# EAGLE design iceWerx Carrier (EAGLE 9.6.2)
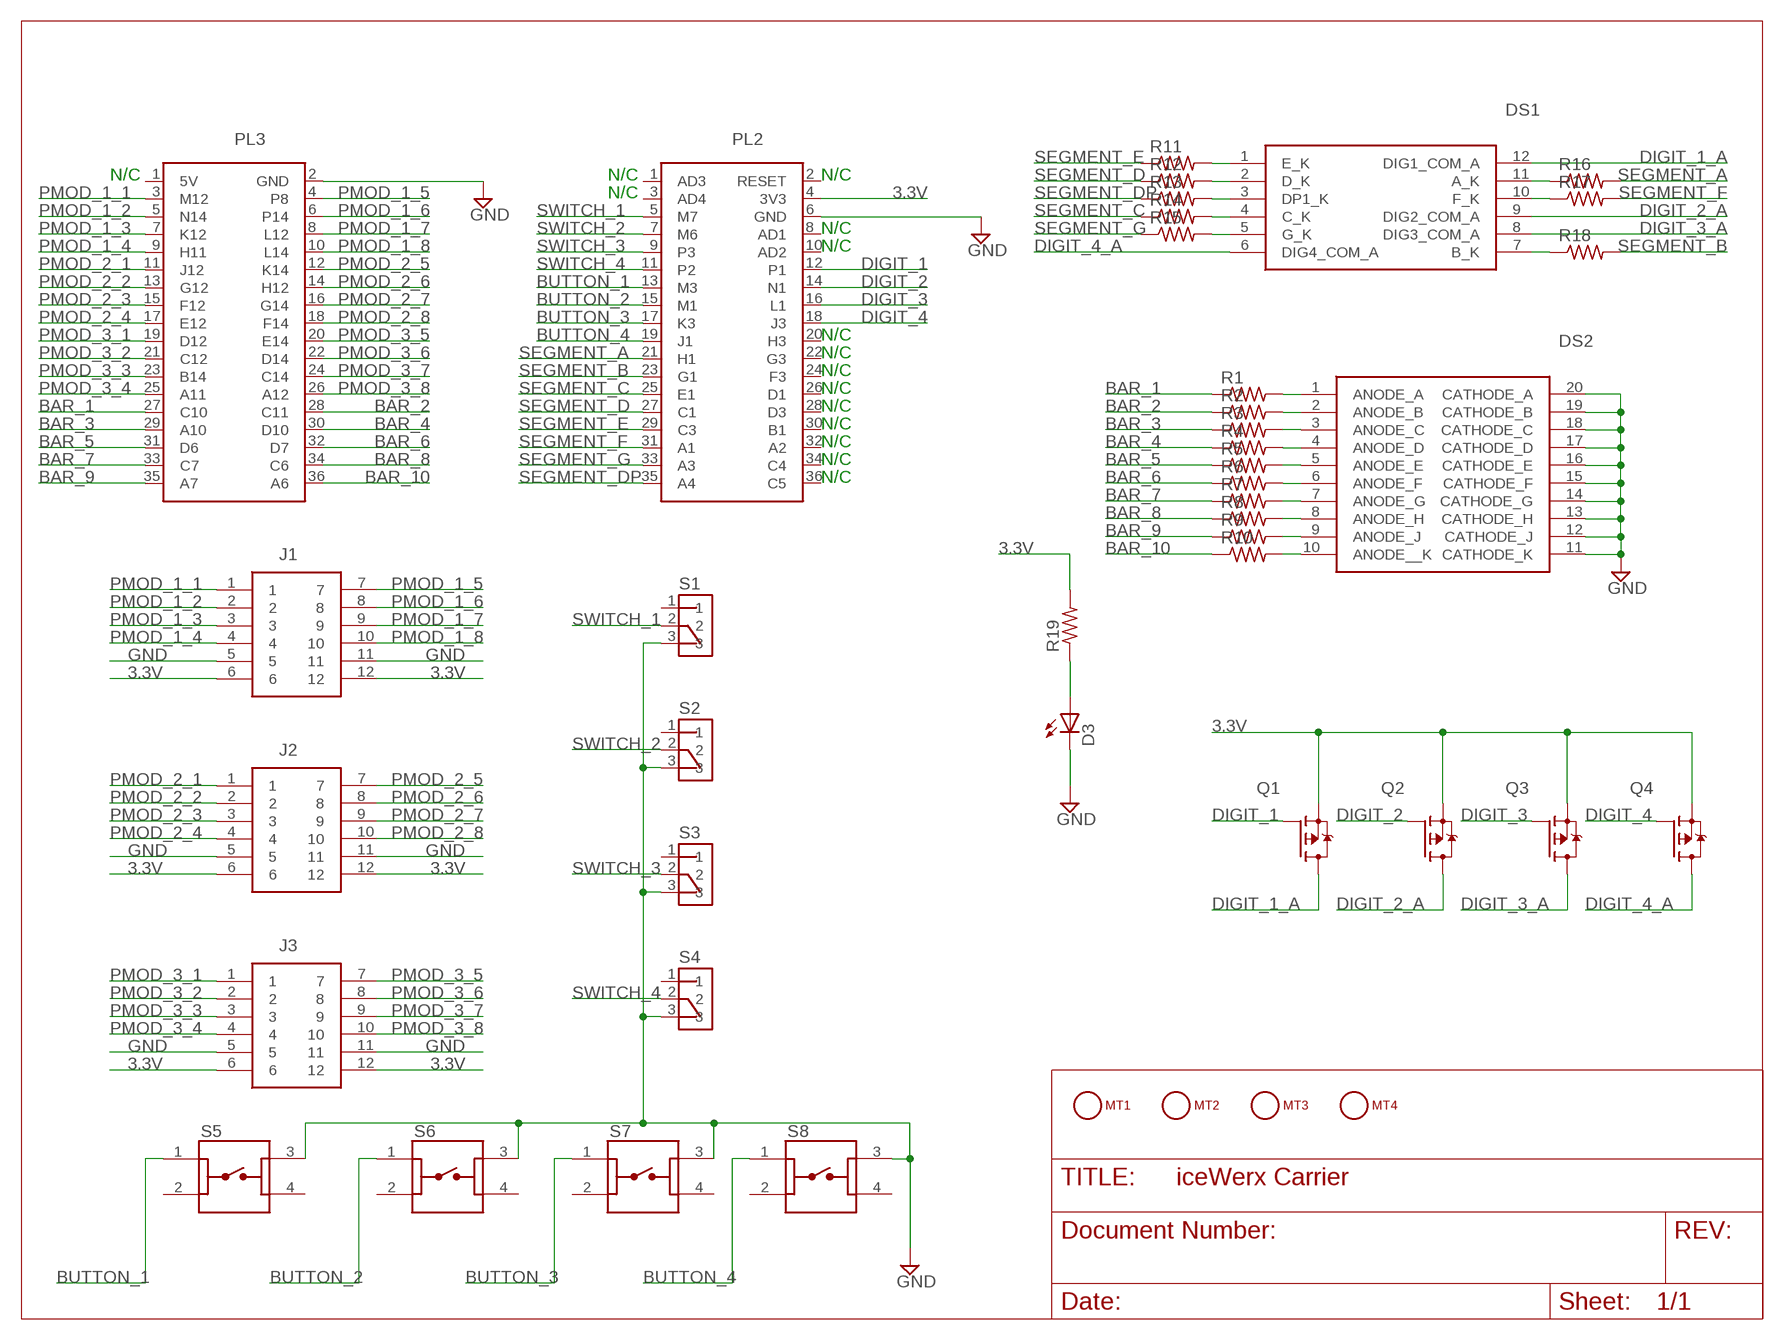
[diagram p0: schematic, sheet 1]

## Parts
D3  LED5MM  [LED5MM]
DS1  LDQ-M282RI  [LDQM282RI]
DS2  LTA-1000G  [DIPS762W50P254L2527H825Q20N]
J1  PMOD-SOCKET-FOR-HOST-BOARD  [PMOD-SOCKET-FOR-HOST-BOARD]
J2  PMOD-SOCKET-FOR-HOST-BOARD  [PMOD-SOCKET-FOR-HOST-BOARD]
J3  PMOD-SOCKET-FOR-HOST-BOARD  [PMOD-SOCKET-FOR-HOST-BOARD]
MT1  MOUNTING_HOLE-125_250_ROUND  [MT_125_250]
MT2  MOUNTING_HOLE-125_250_ROUND  [MT_125_250]
MT3  MOUNTING_HOLE-125_250_ROUND  [MT_125_250]
MT4  MOUNTING_HOLE-125_250_ROUND  [MT_125_250]
PL2  ICEWERX-PL2  [TE_4-1734506-1]
PL3  ICEWERX-PL3  [TE_4-1734506-1]
Q1  NX2301P  [SOT95P230X110-3N]
Q2  NX2301P  [SOT95P230X110-3N]
Q3  NX2301P  [SOT95P230X110-3N]
Q4  NX2301P  [SOT95P230X110-3N]
R1  R-US_0204/5  [0204/5]
R2  R-US_0204/5  [0204/5]
R3  R-US_0204/5  [0204/5]
R4  R-US_0204/5  [0204/5]
R5  R-US_0204/5  [0204/5]
R6  R-US_0204/5  [0204/5]
R7  R-US_0204/5  [0204/5]
R8  R-US_0204/5  [0204/5]
R9  R-US_0204/5  [0204/5]
R10  R-US_0204/5  [0204/5]
R11  R-US_0204/5  [0204/5]
R12  R-US_0204/5  [0204/5]
R13  R-US_0204/5  [0204/5]
R14  R-US_0204/5  [0204/5]
R15  R-US_0204/5  [0204/5]
R16  R-US_0204/5  [0204/5]
R17  R-US_0204/5  [0204/5]
R18  R-US_0204/5  [0204/5]
R19  R-US_0204/5  [0204/5]
S1  OS102011MS2QN1  [SW_OS102011MS2QN1]
S2  OS102011MS2QN1  [SW_OS102011MS2QN1]
S3  OS102011MS2QN1  [SW_OS102011MS2QN1]
S4  OS102011MS2QN1  [SW_OS102011MS2QN1]
S5  1825910-7  [SW_1825910-7]
S6  1825910-7  [SW_1825910-7]
S7  1825910-7  [SW_1825910-7]
S8  1825910-7  [SW_1825910-7]

## Nets
3.3V: J1.6 J1.12 J2.6 J2.12 J3.6 J3.12 PL2.4(3V3) Q1.2(S) Q2.2(S) Q3.2(S) Q4.2(S) R19.2
BAR_1: PL3.27(C10) R1.1
BAR_2: PL3.28(C11) R2.1
BAR_3: PL3.29(A10) R3.1
BAR_4: PL3.30(D10) R4.1
BAR_5: PL3.31(D6) R5.1
BAR_6: PL3.32(D7) R6.1
BAR_7: PL3.33(C7) R7.1
BAR_8: PL3.34(C6) R8.1
BAR_9: PL3.35(A7) R9.1
BAR_10: PL3.36(A6) R10.1
BUTTON_1: PL2.13(M3) S5.1
BUTTON_2: PL2.15(M1) S6.1
BUTTON_3: PL2.17(K3) S7.1
BUTTON_4: PL2.19(J1) S8.1
DIGIT_1: PL2.12(P1) Q1.1(G)
DIGIT_1_A: DS1.12(DIG1_COM_A) Q1.3(D)
DIGIT_2: PL2.14(N1) Q2.1(G)
DIGIT_2_A: DS1.9(DIG2_COM_A) Q2.3(D)
DIGIT_3: PL2.16(L1) Q3.1(G)
DIGIT_3_A: DS1.8(DIG3_COM_A) Q3.3(D)
DIGIT_4: PL2.18(J3) Q4.1(G)
DIGIT_4_A: DS1.6(DIG4_COM_A) Q4.3(D)
GND: D3.K(C) DS2.11(CATHODE_K) DS2.12(CATHODE_J) DS2.13(CATHODE_H) DS2.14(CATHODE_G) DS2.15(CATHODE_F) DS2.16(CATHODE_E) DS2.17(CATHODE_D) DS2.18(CATHODE_C) DS2.19(CATHODE_B) DS2.20(CATHODE_A) J1.5 J1.11 J2.5 J2.11 J3.5 J3.11 PL2.6(GND) PL3.2(GND) S1.3 S2.3 S3.3 S4.3 S5.3 S6.3 S7.3 S8.3
N$1: DS2.8(ANODE_H) R8.2
N$2: DS2.1(ANODE_A) R1.2
N$3: DS2.2(ANODE_B) R2.2
N$4: DS2.3(ANODE_C) R3.2
N$5: DS2.4(ANODE_D) R4.2
N$6: DS2.5(ANODE_E) R5.2
N$7: DS2.6(ANODE_F) R6.2
N$8: DS2.9(ANODE_J) R9.2
N$9: DS2.7(ANODE_G) R7.2
N$10: DS2.10(ANODE__K) R10.2
N$11: DS1.7(B_K) R18.1
N$12: DS1.10(F_K) R17.1
N$13: DS1.11(A_K) R16.1
N$14: DS1.1(E_K) R11.2
N$15: DS1.2(D_K) R12.2
N$16: DS1.3(DP1_K) R13.2
N$17: DS1.4(C_K) R14.2
N$18: DS1.5(G_K) R15.2
N$19: D3.A R19.1
PMOD_1_1: J1.1 PL3.3(M12)
PMOD_1_2: J1.2 PL3.5(N14)
PMOD_1_3: J1.3 PL3.7(K12)
PMOD_1_4: J1.4 PL3.9(H11)
PMOD_1_5: J1.7 PL3.4(P8)
PMOD_1_6: J1.8 PL3.6(P14)
PMOD_1_7: J1.9 PL3.8(L12)
PMOD_1_8: J1.10 PL3.10(L14)
PMOD_2_1: J2.1 PL3.11(J12)
PMOD_2_2: J2.2 PL3.13(G12)
PMOD_2_3: J2.3 PL3.15(F12)
PMOD_2_4: J2.4 PL3.17(E12)
PMOD_2_5: J2.7 PL3.12(K14)
PMOD_2_6: J2.8 PL3.14(H12)
PMOD_2_7: J2.9 PL3.16(G14)
PMOD_2_8: J2.10 PL3.18(F14)
PMOD_3_1: J3.1 PL3.19(D12)
PMOD_3_2: J3.2 PL3.21(C12)
PMOD_3_3: J3.3 PL3.23(B14)
PMOD_3_4: J3.4 PL3.25(A11)
PMOD_3_5: J3.7 PL3.20(E14)
PMOD_3_6: J3.8 PL3.22(D14)
PMOD_3_7: J3.9 PL3.24(C14)
PMOD_3_8: J3.10 PL3.26(A12)
SEGMENT_A: PL2.21(H1) R16.2
SEGMENT_B: PL2.23(G1) R18.2
SEGMENT_C: PL2.25(E1) R14.1
SEGMENT_D: PL2.27(C1) R12.1
SEGMENT_DP: PL2.35(A4) R13.1
SEGMENT_E: PL2.29(C3) R11.1
SEGMENT_F: PL2.31(A1) R17.2
SEGMENT_G: PL2.33(A3) R15.1
SWITCH_1: PL2.5(M7) S1.2
SWITCH_2: PL2.7(M6) S2.2
SWITCH_3: PL2.9(P3) S3.2
SWITCH_4: PL2.11(P2) S4.2
Unconnected: MT1.1 MT2.1 MT3.1 MT4.1 PL2.1(AD3) PL2.2(RESET) PL2.3(AD4) PL2.8(AD1) PL2.10(AD2) PL2.20(H3) PL2.22(G3) PL2.24(F3) PL2.26(D1) PL2.28(D3) PL2.30(B1) PL2.32(A2) PL2.34(C4) PL2.36(C5) PL3.1(5V) S1.1 S2.1 S3.1 S4.1 S5.2 S5.4 S6.2 S6.4 S7.2 S7.4 S8.2 S8.4

## Notes on the sheet
- N/C | N/C | N/C
- N/C
- N/C
- N/C
- N/C
- N/C
- N/C
- N/C
- N/C
- N/C
- N/C
- N/C
- N/C

## Library data of the parts
D3 = eagle-library-engr-240-f22:LED: LED OSRAM: - CHIPLED LG R971, LG N971, LY N971, LG Q971, LY Q971, LO R971, LY R971 LH N974, LH R974 LS Q976, LO Q976, LY Q976 LO Q996 - Hyper CHIPLED LW Q18S LB Q993, LB Q99A, LB R99A - SideLED LS A670, LO A670, LY A670, LG A670, LP A670 LB A673, LV A673, LT A673, LW A673 LH A674 LY A675 LS A676, LA A676, LO A676, LY A676, LW A676 LS A679, LY A679, LG A679 - Hyper Micro SIDELED® LS Y876, LA Y876, LO Y876, LY Y876 LT Y87S - SmartLED LW L88C, LW L88S LB L89C, LB L89S, LG L890 LS L89K, LO L89K, LY L89K LS L896, LA L896, LO L896, LY L896 - TOPLED LS T670, LO T670, LY T670, LG T670, LP T670 LSG T670, LSP T670, LSY T670, LOP T670, LYG T670 LG T671, LOG T671, LSG T671 LB T673, LV T673, LT T673, LW T673 LH T674 LS T676, LA T676, LO T676, LY T676, LB T676, LH T676, LSB T676, LW T676 LB T67C, LV T67C, LT T67C, LS T67K, LO T67K, LY T67K, LW E67C LS E67B, LA E67B, LO E67B, LY E67B, LB E67C, LV E67C, LT E67C LW T67C LS T679, LY T679, LG T679 LS T770, LO T770, LY T770, LG T770, LP T770 LB T773, LV T773, LT T773, LW T773 LH T774 LS E675, LA E675, LY E675, LS T675 LS T776, LA T776, LO T776, LY T776, LB T776 LHGB T686 LT T68C, LB T68C - Hyper Mini TOPLED® LB M676 - Mini TOPLED Santana® LG M470 LS M47K, LO M47K, LY M47K Source: http://www.osram.convergy.de/
DS1 = eagle-library-engr-240-f22:LDQ-M282RI: LED Displays & Accessories LED Display Source: Datasheet <https://componentsearchengine.com/Datasheets/1/LDQ-M282RI.pdf>; DESCRIPTION: LED Displays & Accessories LED Display; HEIGHT: 6.05mm; MANUFACTURER_NAME: Lumex; MANUFACTURER_PART_NUMBER: LDQ-M282RI; MOUSER_PART_NUMBER: 696-LDQ-M282RI; MOUSER_PRICE-STOCK: https://www.mouser.com/Search/Refine.aspx?Keyword=696-LDQ-M282RI
DS2 = eagle-library-engr-240-f22:LTA-1000G: LED Uni-Color Green 565nm 20-Pin PDIP Source: Datasheet <https://optoelectronics.liteon.com/upload/download/DS-30-92-0809/A1000G.pdf>; DESCRIPTION: LED Uni-Color Green 565nm 20-Pin PDIP; HEIGHT: 8.25mm; MANUFACTURER_NAME: Lite-On; MANUFACTURER_PART_NUMBER: LTA-1000G; MOUSER_PART_NUMBER: 859-LTA-1000G; MOUSER_PRICE-STOCK: https://www.mouser.co.uk/ProductDetail/Lite-On/LTA-1000G?qs=%2FTKcI5XXRKq0QINzVmwJHg%3D%3D
J1-J3 = eagle-library-engr-240-f22:PMOD-SOCKET-FOR-HOST-BOARD
MT1-MT4 = eagle-library-engr-240-f22:MOUNTING_HOLE
PL2 = eagle-library-engr-240-f22:ICEWERX-PL2
PL3 = eagle-library-engr-240-f22:ICEWERX-PL3
Q1-Q4 = eagle-library-engr-240-f22:NX2301P; MANUFACTURER: Nexperia; MAXIMUM_PACKAGE_HEIGHT: 1.10 mm; PARTREV: 1; SNAPEDA_PN: NX2301P; STANDARD: IPC 7351B
R1-R19 = eagle-library-engr-240-f22:R-US_: RESISTOR, American symbol
S1-S4 = eagle-library-engr-240-f22:OS102011MS2QN1: Switch Slide ON ON SPDT Top Slide 0.1A 12VDC 10000Cycles PC Pins Thru-Hole Bulk; MANUFACTURER: C&K; STANDARD: MANUFACTURER RECOMMENDATIONS
S5-S8 = eagle-library-engr-240-f22:1825910-7: Switch Tactile OFF (ON) SPST Round Button PC Pins 0.05A 24VDC 100000Cycles 2.55N Thru-Hole Loose; MANUFACTURER: TE Connectivity; PARTREV: C10; STANDARD: Manufacturer Recommendation

## Board
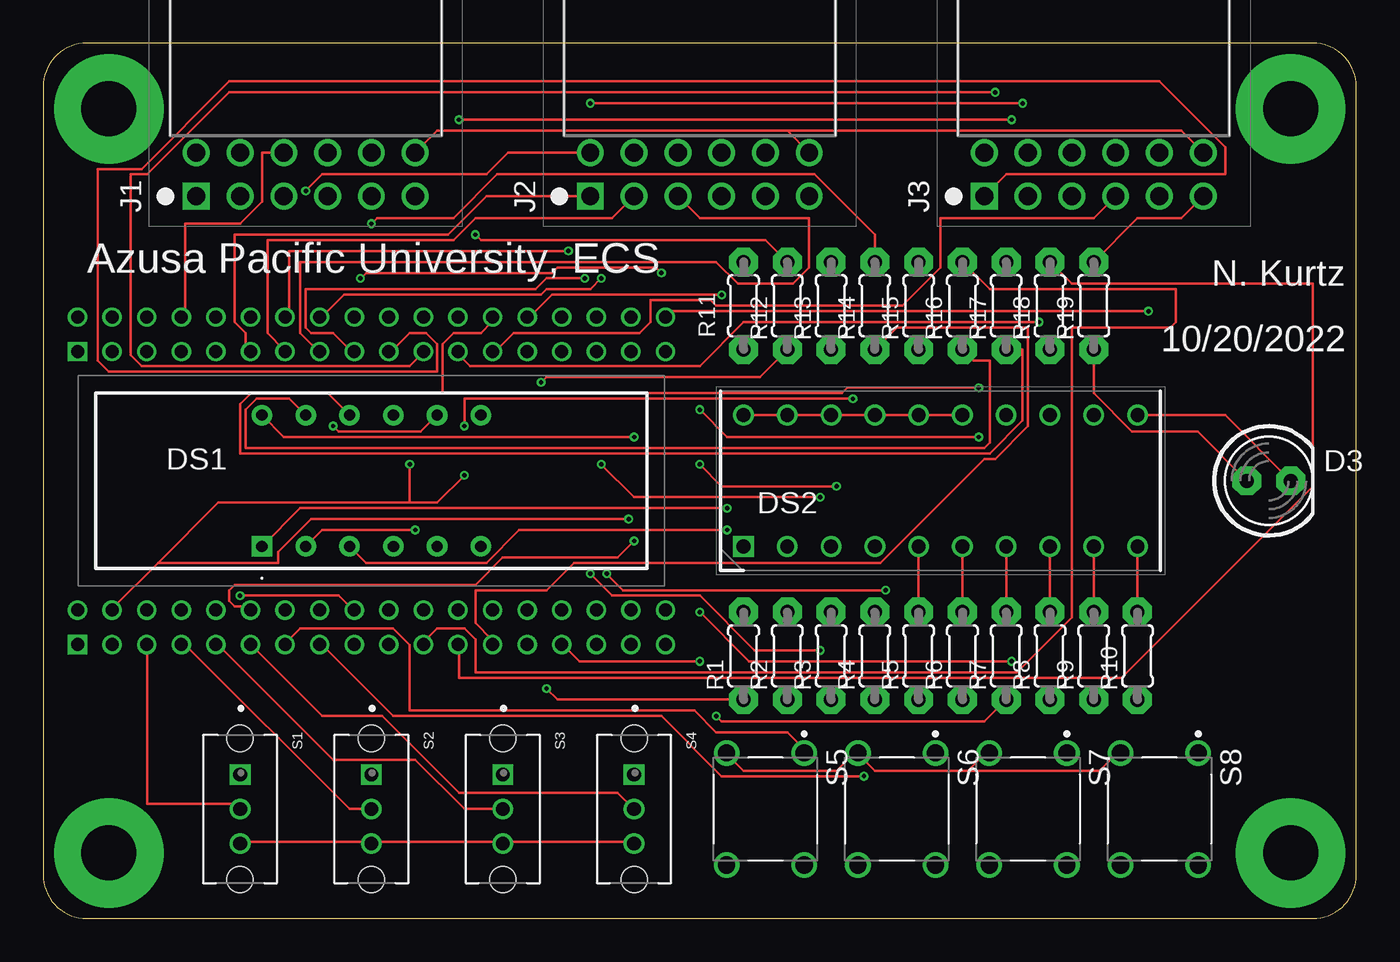
[diagram p1: board, top side]
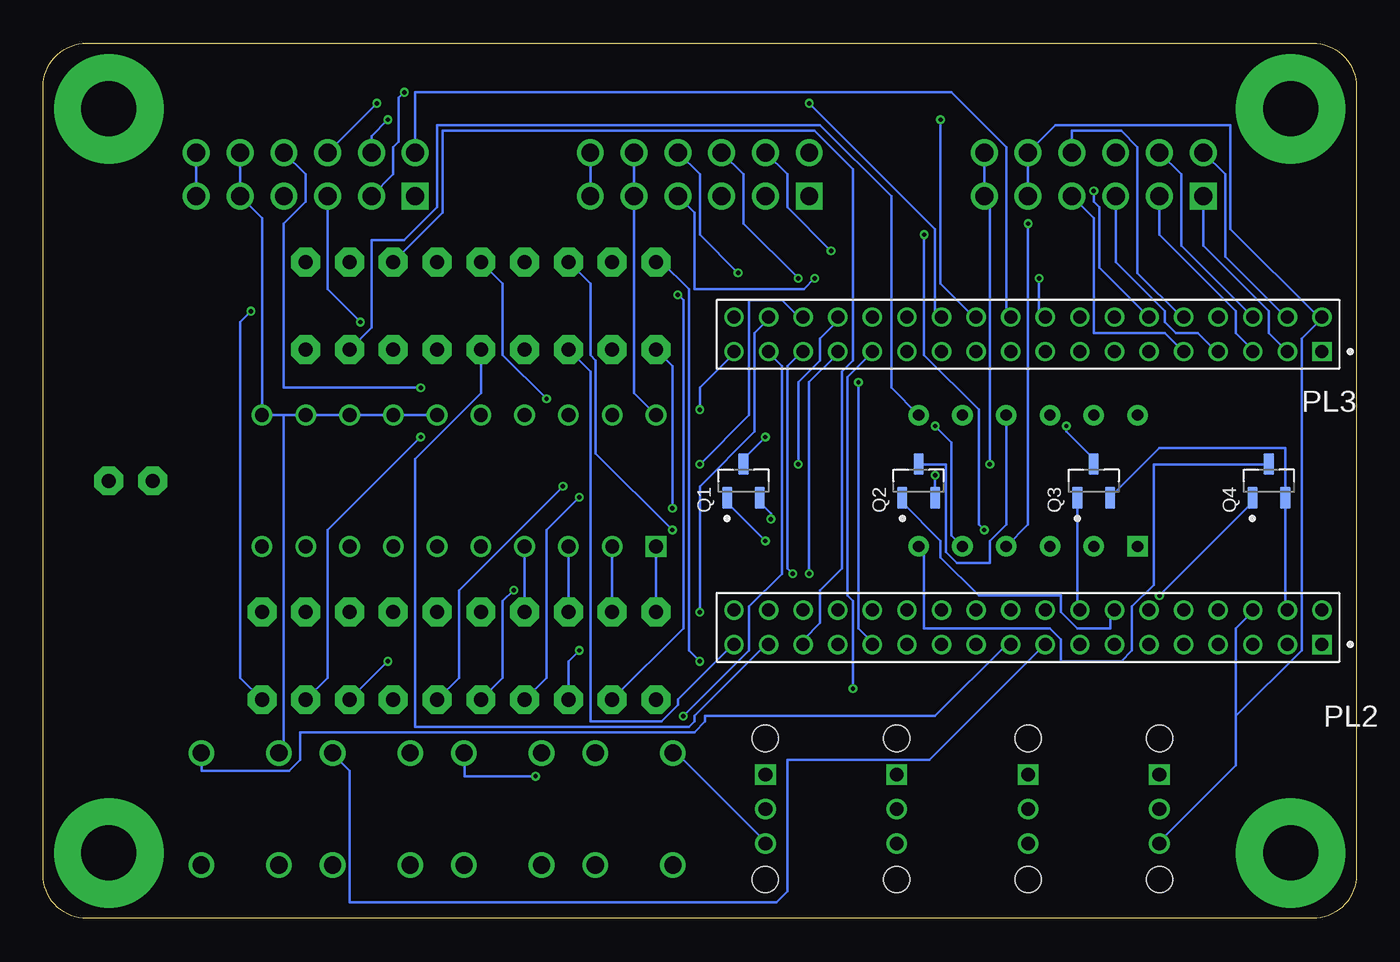
[diagram p2: board, bottom side, seen from below]

Size 76.2 x 50.8 mm. Coordinates in mm from the lower left corner, seen from the top.
Outline: 0,2.54 arc90 2.54,0 73.66,0 arc90 76.2,2.54 76.2,48.26 arc90 73.66,50.8 2.54,50.8 arc90 0,48.26 0,2.54
Copper layers (1*16): Top 0.035559375mm / dielectric 1.6mm / Bottom 0.035559375mm
Design rules "oshpark-2layer *": minimum track width 6mil, minimum drill 10mil, track to track 6mil, track to pad 6mil, pad to pad 6mil, via to via 6mil, smd to smd 6mil, copper to edge 15mil, drill to drill 6mil, minimum pad ring 5mil, minimum via ring 5mil, stop-mask expansion 2.5mil, vias tented up to drill 15mil, thermal gap 10mil

### Footprints (pad centres in the part's own frame; a part is rotated, then mirrored left to right if it is on the bottom)
LED5MM = drill 0.813 pad 1.676 octagon: A -1.27,0; K 1.27,0
LDQM282RI = drill 0.65 pad 1.192 square: 1 0,0 | drill 0.65 pad 1.192: 2 2.54,0; 3 5.08,0; 4 7.62,0; 5 10.16,0; 6 12.7,0; 7 12.7,7.62; 8 10.16,7.62; 9 7.62,7.62; 10 5.08,7.62; 11 2.54,7.62; 12 0,7.62
DIPS762W50P254L2527H825Q20N = drill 0.8 pad 1.2 square: 1 0,0 | drill 0.8 pad 1.2: 2 0,-2.54; 3 0,-5.08; 4 0,-7.62; 5 0,-10.16; 6 0,-12.7; 7 0,-15.24; 8 0,-17.78; 9 0,-20.32; 10 0,-22.86; 11 7.62,-22.86; 12 7.62,-20.32; 13 7.62,-17.78; 14 7.62,-15.24; 15 7.62,-12.7; 16 7.62,-10.16; 17 7.62,-7.62; 18 7.62,-5.08; 19 7.62,-2.54; 20 7.62,0
PMOD-SOCKET-FOR-HOST-BOARD = drill 1.04 pad 1.55 square: 1 0,0 | drill 1.04 pad 1.55: 2 2.54,0; 3 5.08,0; 4 7.62,0; 5 10.16,0; 6 12.7,0; 7 0,2.54; 8 2.54,2.54; 9 5.08,2.54; 10 7.62,2.54; 11 10.16,2.54; 12 12.7,2.54
MT_125_250 = drill 3.175 pad 6.35: 1 0,0
TE_4-1734506-1 = drill 0.75 pad 1.1 square: 1 0,0 | drill 0.75 pad 1.1: 2 0,-2; 3 2.007,0; 4 2.007,-2; 5 4.013,0; 6 4.013,-2; 7 6.02,0; 8 6.02,-2; 9 8.026,0; 10 8.026,-2; 11 10.033,0; 12 10.033,-2; 13 12.04,0; 14 12.04,-2; 15 14.046,0; 16 14.046,-2; 17 16.053,0; 18 16.053,-2; 19 18.059,0; 20 18.059,-2; 21 20.066,0; 22 20.066,-2; 23 22.073,0; 24 22.073,-2; 25 24.079,0; 26 24.079,-2; 27 26.086,0; 28 26.086,-2; 29 28.092,0; 30 28.092,-2; 31 30.099,0; 32 30.099,-2; 33 32.106,0; 34 32.106,-2; 35 34.112,0; 36 34.112,-2
SOT95P230X110-3N = smd 1.26 x 0.59: 1 -0.98,0.95; 2 -0.98,-0.95; 3 0.98,0
0204/5 = drill 0.813 pad 1.676 octagon: 1 -2.54,0; 2 2.54,0
SW_OS102011MS2QN1 = drill 0.8 square: 1 -2,0 | drill 0.8: 2 0,0; 3 2,0 | hole 1.5: -4.1,0; 4.1,0
SW_1825910-7 = drill 0.99: 1 -3.25,2.25; 2 3.25,2.25; 3 -3.25,-2.25; 4 3.25,-2.25

### Placement (x,y rotation side)
D3  71.12,25.4 0 top
DS1  12.7,21.59 0 top
DS2  40.64,21.59 90 top
J1  8.89,41.91 0 top
J2  31.75,41.91 0 top
J3  54.61,41.91 0 top
MT1  3.81,46.99 0 bottom
MT2  72.39,46.99 0 top
MT3  3.81,3.81 0 top
MT4  72.39,3.81 0 top
PL2  2,15.9 180 bottom
PL3  2,32.9 180 bottom
Q1  35.56,25.4 90 bottom
Q2  25.4,25.4 90 bottom
Q3  15.24,25.4 90 bottom
Q4  5.08,25.4 90 bottom
R1  40.64,15.24 90 top
R2  43.18,15.24 90 top
R3  45.72,15.24 90 top
R4  48.26,15.24 90 top
R5  50.8,15.24 90 top
R6  53.34,15.24 90 top
R7  55.88,15.24 90 top
R8  58.42,15.24 90 top
R9  60.96,15.24 90 top
R10  63.5,15.24 90 top
R11  40.64,35.56 270 top
R12  43.18,35.56 90 top
R13  45.72,35.56 90 top
R14  48.26,35.56 90 top
R15  50.8,35.56 90 top
R16  53.34,35.56 90 top
R17  55.88,35.56 90 top
R18  58.42,35.56 90 top
R19  60.96,35.56 90 top
S1  11.43,6.35 270 top
S2  19.05,6.35 270 top
S3  26.67,6.35 270 top
S4  34.29,6.35 270 top
S5  41.91,6.35 270 top
S6  49.53,6.35 270 top
S7  57.15,6.35 270 top
S8  64.77,6.35 270 top

### Tracks (layer width: path | path; a pad name or v marks a point on that pad's centre or on a via)
3.3V  (via drill 0.25)
  Top 0.152: v24.45,25.72 22.86,24.13 21.27,24.13 | 21.27,24.13 10.16,24.13 6.67,20.64 | 6.67,20.64 4.13,18.1 PL2.4 | v33.97,23.18 15.56,23.18 13.65,21.27 13.65,20.64 6.67,20.64 | R19.2 63.5,40.64 66.04,40.64 J3.6 | J1.12 22.86,45.72 43.18,45.72 | J2.12 43.18,45.72 | J3.12 66.04,45.72 43.18,45.72 | v21.27,26.35 21.27,24.13
  Bottom 0.152: PL2.4 4.13,18.1 4.13,24.13 Q4.2 4.13,24.45 4.13,27.3 11.43,27.3 14.29,24.45 Q3.2 | v24.45,25.72 24.45,24.45 Q2.2 | v33.97,23.18 33.97,23.5 34.61,24.13 Q1.2 | J3.12 J3.6 | J1.12 J1.6 21.27,41.59 v21.27,26.35 | J2.12 J2.6
BAR_1  (via drill 0.25)
  Top 0.152: v29.21,13.34 29.84,12.7 R1.1
  Bottom 0.152: v29.21,13.34 29.21,18.41 29.53,18.73 29.53,31.43 28.26,32.7 PL3.27
BAR_2  (via drill 0.25)
  Top 0.152: v39.37,36.2 29.53,36.2 28.26,34.92 PL3.28
  Bottom 0.152: v39.37,36.2 39.05,35.88 39.05,16.83 R2.1
BAR_3  (via drill 0.25)
  Top 0.152: v31.75,20 33.02,18.73 38.1,18.73 41.27,15.56 v45.09,15.56
  Bottom 0.152: v31.75,20 31.75,31.11 30.16,32.7 PL3.29 | v45.09,15.56 45.72,14.92 R3.1
BAR_4  (via drill 0.25)
  Top 0.152: v32.38,26.35 34.29,24.45 v45.09,24.45
  Bottom 0.152: v32.38,26.35 32.38,31.11 31.11,32.38 31.11,33.66 30.16,34.61 PL3.30 | v45.09,24.45 46.99,22.54 46.99,13.97 R4.1
BAR_5  (via drill 0.25)
  Top 0.152: v32.7,20 33.66,19.05 v48.9,19.05
  Bottom 0.152: v32.7,20 33.02,20.32 33.02,32.07 32.38,32.7 PL3.31 | v48.9,19.05 49.53,18.41 49.53,13.97 R5.1
BAR_6  (via drill 0.25)
  Top 0.152: v38.1,26.35 39.37,25.08 v46.04,25.08
  Bottom 0.152: v38.1,26.35 35.24,29.21 35.24,35.88 33.34,35.88 32.38,34.92 PL3.32 | v46.04,25.08 52.07,19.05 52.07,13.97 R6.1
BAR_7  (via drill 0.25)
  Top 0.152: v39.05,11.75 39.37,11.43 54.61,11.43 R7.1
  Bottom 0.152: v39.05,11.75 35.24,15.56 35.24,18.1 33.34,20 33.34,32.07 33.97,32.7 PL3.33
BAR_8  (via drill 0.25)
  Top 0.152: v38.1,17.78 40.96,14.92 v56.2,14.92
  Bottom 0.152: v38.1,17.78 38.1,25.08 34.92,28.26 34.92,33.97 34.29,34.61 PL3.34 | R8.1 v56.2,14.92
BAR_9  (via drill 0.25)
  Top 0.152: v38.1,29.53 39.69,27.94 v54.29,27.94
  Bottom 0.152: v38.1,29.53 38.1,30.8 36.2,32.7 PL3.35 | v54.29,27.94 59.69,22.54 59.69,13.97 R9.1
BAR_10  (via drill 0.25)
  Top 0.152: v64.14,35.24 36.51,35.24 36.2,34.92 PL3.36
  Bottom 0.152: v64.14,35.24 64.77,34.61 64.77,13.97 R10.1
BUTTON_1
  Top 0.152: PL2.13 14.29,16.19 14.92,16.83 20.32,16.83 21.27,15.88 21.27,12.06 37.78,12.06 39.05,10.79 43.18,10.79 44.13,9.84 S5.1
BUTTON_2  (via drill 0.25)
  Top 0.152: v47.62,8.26 39.37,8.26 35.88,11.75 20.32,11.75 16.19,15.88 PL2.15
  Bottom 0.152: v47.62,8.26 51.75,8.26 51.75,9.53 S6.1
BUTTON_3
  Bottom 0.152: PL2.17 18.1,15.88 24.77,9.21 33.02,9.21 33.02,1.59 33.66,0.95 58.42,0.95 58.42,8.57 59.37,9.53 S7.1
BUTTON_4
  Bottom 0.152: PL2.19 20.32,15.88 24.45,11.75 37.78,11.75 37.78,11.43 38.42,10.79 61.28,10.79 61.28,9.21 61.91,8.57 66.99,8.57 66.99,9.53 S8.1
DIGIT_1  (via drill 0.25)
  Top 0.152: v34.29,21.91 33.34,20.95 26.67,20.95 25.08,19.37 11.11,19.37 10.79,19.05 10.79,18.41 11.11,18.1 11.75,18.1 PL2.12
  Bottom 0.152: v34.29,21.91 36.51,24.13 Q1.1
DIGIT_1_A  (via drill 0.25)
  Top 0.152: v34.29,27.94 13.97,27.94 DS1.12
  Bottom 0.152: v34.29,27.94 35.56,26.67 Q1.3
DIGIT_2
  Bottom 0.152: Q2.1 26.35,24.13 24.13,21.91 24.13,20.95 21.91,18.73 17.14,18.73 17.14,17.78 16.19,16.83 14.29,16.83 14.29,17.78 PL2.14
DIGIT_2_A
  Bottom 0.152: DS1.9 20.32,22.86 21.27,21.91 21.27,20.64 23.18,20.64 23.81,21.27 23.81,26.35 25.4,26.35 Q2.3
DIGIT_3
  Bottom 0.152: Q3.1 16.19,24.13 16.19,18.1 PL2.16
DIGIT_3_A  (via drill 0.25)
  Top 0.152: v16.83,28.57 17.14,28.26 21.91,28.26 DS1.8
  Bottom 0.152: v16.83,28.57 16.83,28.26 15.24,26.67 Q3.3
DIGIT_4  (via drill 0.25)
  Top 0.152: v11.43,18.73 17.14,18.73 17.78,18.1 PL2.18
  Bottom 0.152: v11.43,18.73 6.03,24.13 Q4.1
DIGIT_4_A
  Bottom 0.152: DS1.6 25.08,21.27 25.08,16.83 17.78,16.83 17.14,16.19 17.14,14.92 13.65,14.92 13.02,15.56 13.02,18.1 11.75,19.37 11.75,26.35 5.08,26.35 Q4.3
GND
  Top 0.152: DS2.20 DS2.19 DS2.18 DS2.17 DS2.16 DS2.15 | D3.K 68.58,29.21 DS2.11 | 53.66,8.57 48.26,8.57 47.31,9.53 S6.3 46.99,9.53 46.04,8.57 40.64,8.57 39.69,9.53 S5.3 | 53.66,8.57 54.61,9.53 S7.3 | 53.66,8.57 61.28,8.57 62.23,9.53 S8.3 | 19.05,4.45 11.43,4.45 S1.3 | 19.05,4.45 26.67,4.45 | 19.05,4.45 S2.3 | 26.67,4.45 34.29,4.45 S4.3 | 26.67,4.45 S3.3
  Bottom 0.152: J3.11 J3.5 63.5,40.64 DS2.11 62.23,29.21 | J2.11 J2.5 41.91,30.48 DS2.20 | DS2.15 DS2.14 DS2.13 DS2.12 62.23,29.21 | S4.3 34.29,4.45 39.37,9.53 S5.3 | J1.5 J1.11 17.46,46.04 7.3,46.04 7.3,40.01 2.22,34.92 PL3.2 2.22,34.61 3.17,33.66 3.17,15.56 6.99,11.75 | 6.99,11.75 6.99,8.89 11.43,4.45 S1.3 | 6.99,11.75 6.99,16.83 6.03,17.78 PL2.6 | 62.23,29.21 62.23,9.84 S8.3
N$1
  Top 0.152: R8.2 DS2.8
N$2
  Bottom 0.152: R1.2 DS2.1
N$3
  Bottom 0.152: R2.2 DS2.2
N$4
  Bottom 0.152: R3.2 DS2.3
N$5
  Bottom 0.152: R4.2 DS2.4
N$6
  Top 0.152: R5.2 DS2.5
N$7
  Top 0.152: R6.2 DS2.6
N$8
  Top 0.152: R9.2 DS2.9
N$9
  Top 0.152: R7.2 DS2.7
N$10
  Top 0.152: R10.2 DS2.10
N$11
  Bottom 0.152: DS1.7 26.99,30.8 26.99,41.91 31.11,46.04 53.34,46.04 53.34,41.27 55.24,39.37 57.15,39.37 57.15,34.29 R18.1
N$12
  Top 0.152: DS1.10 16.51,30.48 12.06,30.48 11.43,29.84 11.43,26.99 54.93,26.99 56.83,28.89 56.83,33.02 R17.1
N$13
  Top 0.152: DS1.11 14.29,30.16 12.38,30.16 11.75,29.53 11.75,27.3 54.61,27.3 54.93,27.62 54.93,32.38 53.98,32.38 R16.1
N$14  (via drill 0.25)
  Top 0.152: DS1.1 14.92,23.81 v39.69,23.81
  Bottom 0.152: v39.69,23.81 39.69,32.07 R11.2
N$15  (via drill 0.25)
  Top 0.152: DS1.2 16.19,22.54 v21.59,22.54 | v25.08,39.69 25.4,39.37 41.91,39.37 R12.2
  Bottom 0.152: v21.59,22.54 21.91,22.86 21.91,29.53 25.08,32.7 v25.08,39.69
N$16  (via drill 0.25)
  Top 0.152: DS1.3 18.73,20.64 25.72,20.64 27.62,22.54 v39.69,22.54
  Bottom 0.152: v39.69,22.54 44.13,26.99 44.13,32.38 44.45,32.7 44.45,36.83 R13.2
N$17  (via drill 0.25)
  Top 0.152: v19.05,40.32 19.37,40.64 23.81,40.64 26.35,43.18 44.77,43.18 48.26,39.69 R14.2
  Bottom 0.152: DS1.4 19.05,22.86 v19.05,40.32
N$18  (via drill 0.25)
  Top 0.152: v24.45,28.57 24.45,30.16 v46.99,30.16
  Bottom 0.152: DS1.5 23.5,22.23 23.5,27.62 v24.45,28.57 | v46.99,30.16 49.53,32.7 49.53,36.83 R15.2
N$19
  Top 0.152: D3.A 66.99,28.26 63.18,28.26 60.96,30.48 R19.1
PMOD_1_1
  Bottom 0.152: J1.1 8.89,39.05 5.08,35.24 5.08,33.97 4.13,33.02 PL3.3
PMOD_1_2
  Bottom 0.152: J1.2 11.43,39.69 6.99,35.24 6.99,33.97 6.03,33.02 PL3.5
PMOD_1_3
  Bottom 0.152: J1.3 13.97,38.1 11.11,35.24 11.11,34.61 10.48,33.97 9.21,33.97 8.26,33.02 PL3.7
PMOD_1_4
  Bottom 0.152: J1.4 15.24,40.64 15.24,33.97 11.11,33.97 10.16,33.02 PL3.9
PMOD_1_5
  Bottom 0.152: J1.7 7.62,43.18 7.62,38.42 4.13,34.92 PL3.4
PMOD_1_6
  Bottom 0.152: J1.8 10.16,43.18 10.16,39.05 6.03,34.92 PL3.6
PMOD_1_7
  Top 0.152: J1.9 12.7,44.45 12.7,41.59 11.43,40.32 8.26,40.32 8.26,34.92 PL3.8
PMOD_1_8
  Bottom 0.152: J1.10 16.51,45.72 13.65,45.72 12.7,44.77 12.7,37.47 10.16,34.92 PL3.10
PMOD_2_1
  Top 0.152: J2.1 25.72,41.91 23.5,39.69 11.11,39.69 11.11,34.61 11.75,33.97 11.75,33.02 PL3.11
PMOD_2_2
  Top 0.152: J2.2 33.02,40.64 25.08,40.64 23.81,39.37 13.02,39.37 13.02,33.97 13.97,33.02 PL3.13
PMOD_2_3
  Top 0.152: J2.3 38.1,40.64 44.45,40.64 44.45,37.78 43.5,36.83 40.32,36.83 39.05,38.1 14.92,38.1 14.92,33.97 15.88,33.02 PL3.15
PMOD_2_4  (via drill 0.25)
  Top 0.152: v31.43,37.15 29.21,37.15 28.57,36.51 15.24,36.51 15.24,34.29 15.56,33.97 16.83,33.97 17.78,33.02 PL3.17
  Bottom 0.152: v31.43,37.15 32.07,36.51 38.42,36.51 38.42,40.96 J2.4
PMOD_2_5  (via drill 0.25)
  Top 0.152: v15.24,42.23 16.19,43.18 25.72,43.18 26.99,44.45 J2.7
  Bottom 0.152: v15.24,42.23 15.24,41.59 14.92,41.27 14.92,37.78 12.06,34.92 PL3.12
PMOD_2_6  (via drill 0.25)
  Top 0.152: v30.48,38.73 14.29,38.73 14.29,34.92 PL3.14
  Bottom 0.152: v30.48,38.73 33.02,41.27 33.02,43.18 J2.8
PMOD_2_7  (via drill 0.25)
  Top 0.152: v32.38,37.15 31.75,36.51 29.21,36.51 28.89,36.2 17.46,36.2 16.19,34.92 PL3.16
  Bottom 0.152: v32.38,37.15 35.56,40.32 35.56,43.18 J2.9
PMOD_2_8  (via drill 0.25)
  Top 0.152: v18.41,37.15 18.73,37.47 29.53,37.47 29.84,37.78 35.56,37.78 v35.88,37.47
  Bottom 0.152: v18.41,37.15 18.41,35.24 18.1,34.92 PL3.18 | v35.88,37.47 38.1,39.69 38.1,43.18 J2.10
PMOD_3_1
  Top 0.152: J3.1 55.88,43.18 68.58,43.18 68.58,44.77 64.77,48.58 10.79,48.58 5.71,43.5 3.17,43.5 3.17,32.38 3.81,31.75 22.86,31.75 22.86,33.34 22.23,33.97 21.27,33.97 20.32,33.02 PL3.19
PMOD_3_2  (via drill 0.25)
  Top 0.152: v55.24,47.94 10.79,47.94 6.03,43.18 5.08,43.18 5.08,32.7 5.71,32.07 21.27,32.07 21.91,32.7 PL3.21
  Bottom 0.152: v55.24,47.94 55.56,47.62 55.56,45.09 55.88,44.77 55.88,43.18 J3.2
PMOD_3_3  (via drill 0.25)
  Top 0.152: v57.78,34.61 40.64,34.61 38.1,32.07 24.77,32.07 24.13,32.7 PL3.23
  Bottom 0.152: v57.78,34.61 59.69,36.51 J3.3
PMOD_3_4
  Top 0.152: J3.4 60.96,40.64 52.07,40.64 52.07,37.78 49.85,35.56 39.05,35.56 38.73,35.88 35.24,35.88 35.24,34.61 34.61,33.97 27.3,33.97 26.35,33.02 PL3.25
PMOD_3_5
  Bottom 0.152: J3.7 54.61,47.94 23.5,47.94 20.32,44.77 20.32,34.92 PL3.20
PMOD_3_6  (via drill 0.25)
  Top 0.152: v56.2,46.35 v24.13,46.35
  Bottom 0.152: v24.13,46.35 24.13,36.83 22.23,34.92 PL3.22 | v56.2,46.35 57.15,45.4 J3.8
PMOD_3_7  (via drill 0.25)
  Top 0.152: v56.83,47.31 v31.75,47.31
  Bottom 0.152: v31.75,47.31 24.45,40.01 24.45,35.24 24.13,34.92 PL3.24 | J3.9 v56.83,47.31
PMOD_3_8  (via drill 0.25)
  Top 0.152: v54.29,30.8 46.67,30.8 46.35,30.48 23.18,30.48 23.18,33.34 23.81,33.97 25.4,33.97 26.04,34.61 PL3.26
  Bottom 0.152: v54.29,30.8 62.23,30.8 62.23,40.32 60.96,41.59 60.96,43.18 J3.10
SEGMENT_A
  Top 0.152: R16.2 54.93,36.51 65.72,36.51 65.72,34.61 65.41,34.29 59.69,34.29 59.69,17.46 56.52,14.29 25.08,14.29 25.08,16.19 24.45,16.83 22.86,16.83 22.23,16.19 PL2.21
SEGMENT_B
  Top 0.152: R18.2 59.69,36.83 73.66,36.83 73.66,25.08 62.55,13.97 24.13,13.97 24.13,15.88 PL2.23
SEGMENT_C
  Top 0.152: R14.1 49.53,34.29 57.15,34.29 57.15,28.57 55.24,26.67 54.61,26.67 48.58,20.64 30.8,20.64 29.21,19.05 25.08,19.05 25.08,17.14 26.04,16.19 PL2.25
SEGMENT_D  (via drill 0.25)
  Top 0.152: v28.89,31.11 29.21,31.43 41.59,31.43 R12.1
  Bottom 0.152: v28.89,31.11 28.89,16.83 28.26,16.19 PL2.27
SEGMENT_DP
  Bottom 0.152: R13.1 44.45,31.75 44.45,11.43 40.32,11.43 39.37,12.38 39.37,12.7 36.2,15.88 PL2.35
SEGMENT_E  (via drill 0.25)
  Top 0.152: v38.1,14.92 31.11,14.92 30.16,15.88 PL2.29
  Bottom 0.152: v38.1,14.92 38.73,15.56 38.73,36.51 40.32,38.1 R11.1
SEGMENT_F
  Bottom 0.152: R17.2 53.02,40.96 53.02,45.72 31.43,45.72 29.21,43.5 29.21,32.38 29.84,31.75 29.84,20.32 31.11,19.05 31.11,17.14 32.07,16.19 PL2.31
SEGMENT_G
  Bottom 0.152: R15.1 50.8,30.48 54.61,26.67 54.61,11.11 38.73,11.11 38.42,11.43 38.42,11.75 34.29,15.88 PL2.33
SWITCH_1
  Top 0.152: S1.2 11.11,6.67 6.03,6.67 6.03,15.88 PL2.5
SWITCH_2
  Top 0.152: S2.2 17.78,6.35 8.26,15.88 PL2.7
SWITCH_3
  Top 0.152: S3.2 24.45,6.35 21.59,9.21 16.83,9.21 10.16,15.88 PL2.9
SWITCH_4
  Top 0.152: S4.2 33.34,7.3 24.13,7.3 19.68,11.75 16.19,11.75 12.06,15.88 PL2.11

### Text on the board
tPlace: Azusa Pacific University, ECS | N. Kurtz | 10/20/2022